# EAGLE schematic tinycopter v2 (EAGLE 6.3)
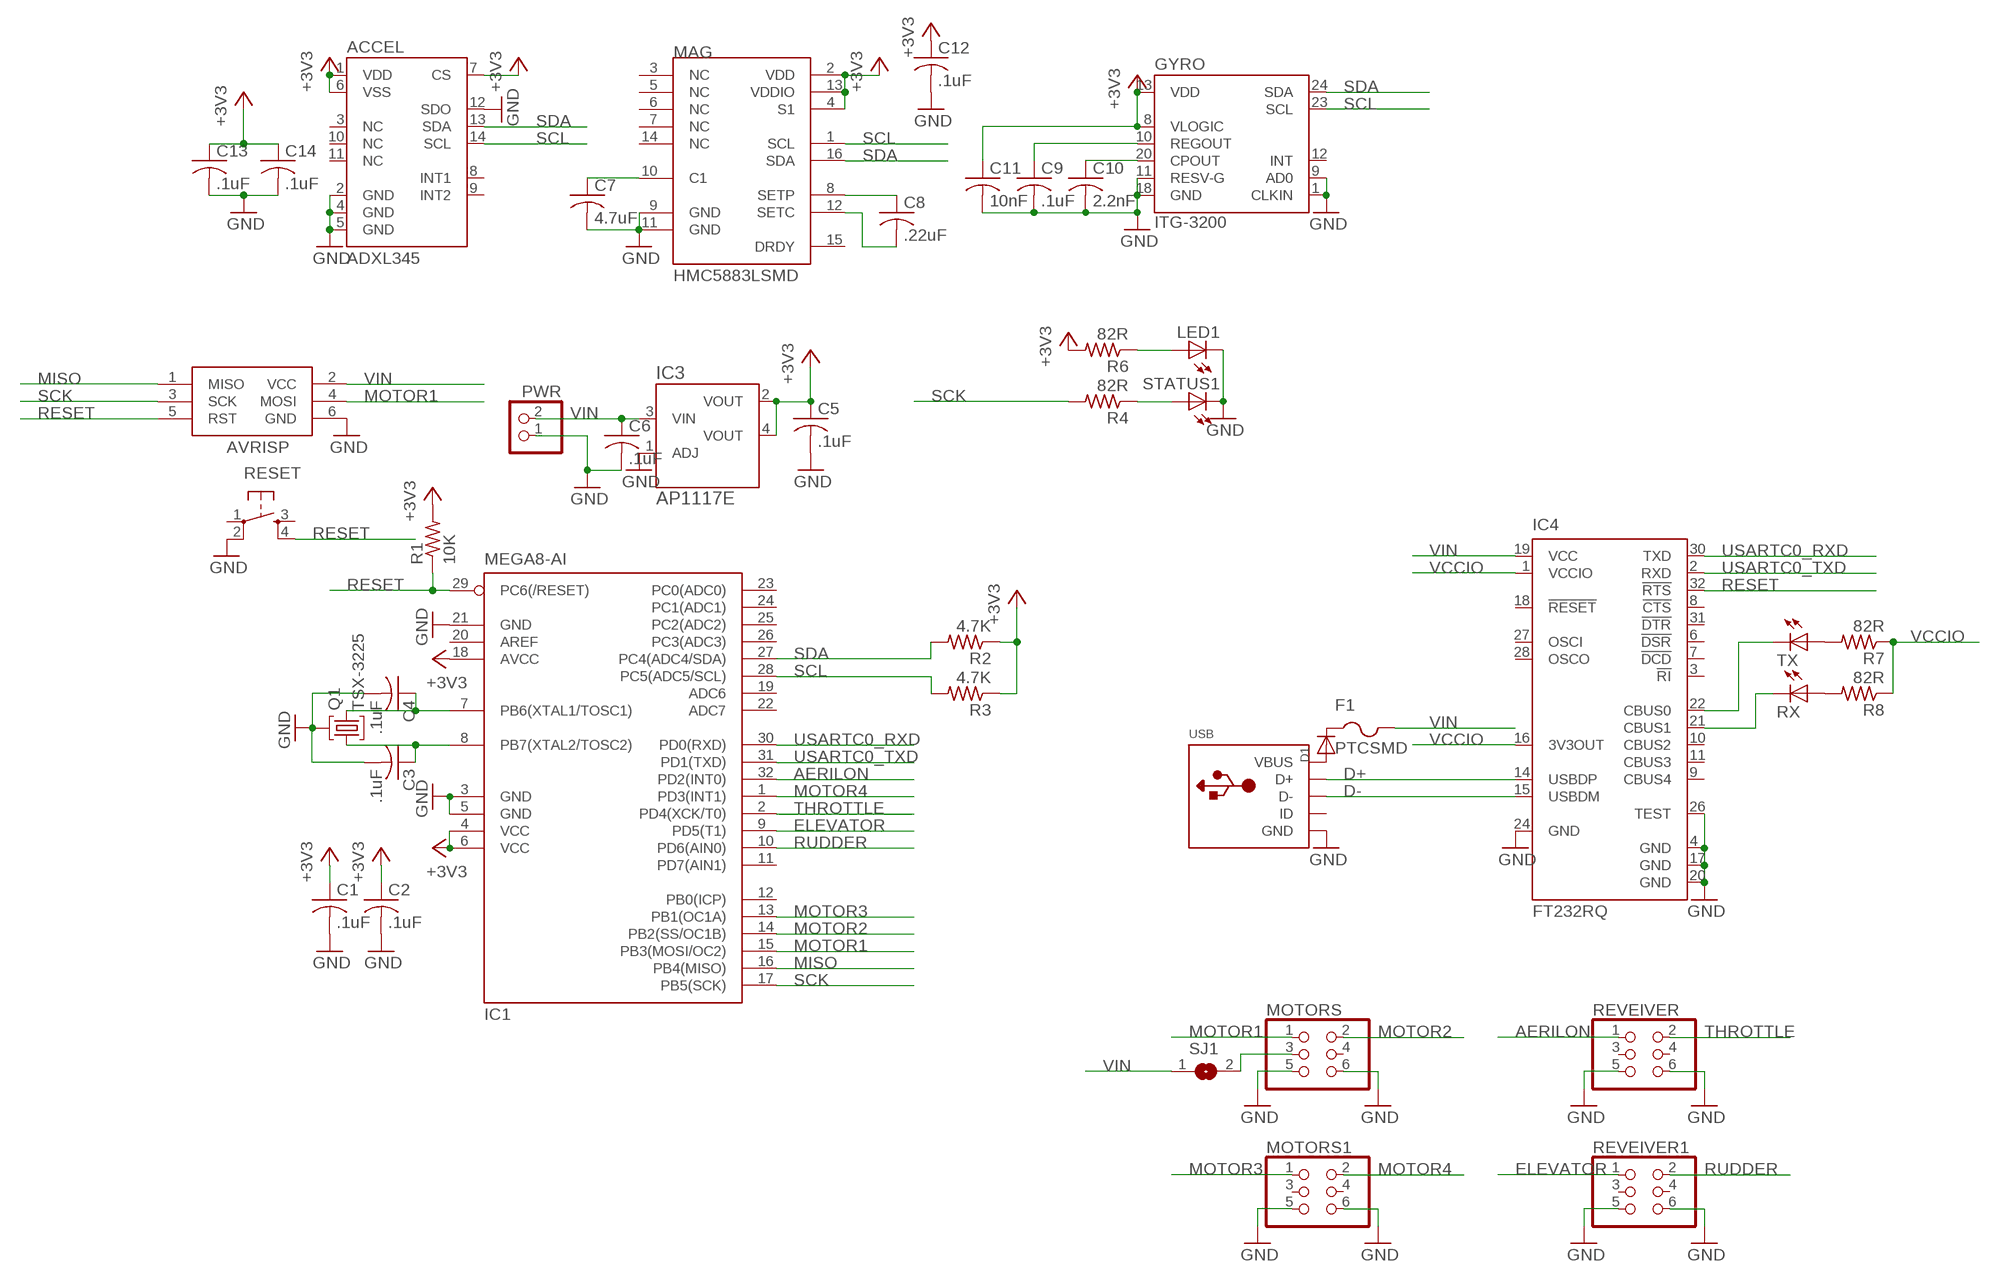
[diagram p0: schematic, sheet 1]

## Parts
ACCEL  ADXL345  [LGA14]
AVRISP  AVRISP-6  [AVRISP]
C1  .1uF  C-USC0603  [C0603]
C2  .1uF  C-USC0603  [C0603]
C3  .1uF  C-USC0603  [C0603]
C4  .1uF  C-USC0603  [C0603]
C5  .1uF  C-USC0603  [C0603]
C6  .1uF  C-USC0603  [C0603]
C7  4.7uF  C-USC0805K  [C0805K]
C8  .22uF  C-USC0603  [C0603]
C9  .1uF  C-USC0603  [C0603]
C10  2.2nF  C-USC0603  [C0603]
C11  10nF  C-USC0603  [C0603]
C12  .1uF  C-USC0603  [C0603]
C13  .1uF  C-USC0603  [C0603]
C14  .1uF  C-USC0603  [C0603]
D1  DIODESOD-123  [SOD-123]
F1  PTCSMD  PTCFUSE-1812  [1812]
GYRO  ITG-3200  [QFN-24]
IC1  MEGA8-AI  [TQFP32-08]
IC3  AP1117E  [SOT223-3]
IC4  FT232RQ  [QFN32]
LED1  LEDCHIP-LED0805  [CHIP-LED0805]
MAG  HMC5883LSMD  [16LPCC]
MOTORS  PINHD-2X3  [2X03]
MOTORS1  PINHD-2X3  [2X03]
PWR  JST_2PIN-THM  [JST-PH-2-THM]
Q1  TSX-3225  [TSX-3225]
R1  10K  R-US_R0603  [R0603]
R2  4.7K  R-US_R0603  [R0603]
R3  4.7K  R-US_R0603  [R0603]
R4  82R  R-US_R0603  [R0603]
R6  82R  R-US_R0603  [R0603]
R7  82R  R-US_R0603  [R0603]
R8  82R  R-US_R0603  [R0603]
RESET  TAC_SWITCHSMD  [TACTILE_SWITCH_SMD]
REVEIVER  PINHD-2X3  [2X03]
REVEIVER1  PINHD-2X3  [2X03]
RX  LEDCHIP-LED0805  [CHIP-LED0805]
SJ1  SJ  [SJ]
STATUS1  LEDCHIP-LED0805  [CHIP-LED0805]
TX  LEDCHIP-LED0805  [CHIP-LED0805]
USB  USBMINIB  [USB-MINIB]

## Nets
+3V3: ACCEL.1(VDD) ACCEL.6(VSS) ACCEL.7(CS) C1.1 C2.1 C5.1 C11.1 C12.1 C13.1 C14.1 GYRO.8(VLOGIC) GYRO.13(VDD) IC1.4(VCC) IC1.6(VCC) IC1.18(AVCC) IC3.2(VOUT) IC3.4(VOUT) MAG.2(VDD) MAG.4(S1) MAG.13(VDDIO) R1.2 R2.1 R3.1 R6.2
AERILON: IC1.32(PD2(INT0)) REVEIVER.1
D+: IC4.14(USBDP) USB.D+
D-: IC4.15(USBDM) USB.D-
ELEVATOR: IC1.9(PD5(T1)) REVEIVER1.1
GND: ACCEL.2(GND) ACCEL.4(GND) ACCEL.5(GND) ACCEL.12(SDO) AVRISP.6(GND) C1.2 C2.2 C3.2 C4.2 C5.2 C6.2 C7.2 C9.2 C10.2 C11.2 C12.2 C13.2 C14.2 GYRO.1(CLKIN) GYRO.9(AD0) GYRO.11(RESV-G) GYRO.18(GND) IC1.3(GND) IC1.5(GND) IC1.21(GND) IC3.1(ADJ) IC4.4(GND) IC4.17(GND) IC4.20(GND) IC4.24(GND) IC4.26(TEST) LED1.C MAG.9(GND) MAG.11(GND) MOTORS1.5 MOTORS1.6 MOTORS.5 MOTORS.6 PWR.1 Q1.2 Q1.4 RESET.2 REVEIVER1.5 REVEIVER1.6 REVEIVER.5 REVEIVER.6 STATUS1.C USB.GND
MISO: AVRISP.1(MISO) IC1.16(PB4(MISO))
MOTOR1: AVRISP.4(MOSI) IC1.15(PB3(MOSI/OC2)) MOTORS.1
MOTOR2: IC1.14(PB2(SS/OC1B)) MOTORS.2
MOTOR3: IC1.13(PB1(OC1A)) MOTORS1.1
MOTOR4: IC1.1(PD3(INT1)) MOTORS1.2
N$1: C4.1 IC1.7(PB6(XTAL1/TOSC1)) Q1.3
N$2: C3.1 IC1.8(PB7(XTAL2/TOSC2)) Q1.1
N$3: R4.1 STATUS1.A
N$5: C10.1 GYRO.20(CPOUT)
N$6: C7.1 MAG.10(C1)
N$7: C8.1 MAG.8(SETP)
N$8: LED1.A R6.1
N$9: C8.2 MAG.12(SETC)
N$10: C9.1 GYRO.10(REGOUT)
N$11: IC4.22(CBUS0) TX.C
N$12: IC4.21(CBUS1) RX.C
N$13: R7.2 TX.A
N$14: D1.A USB.VBUS
N$15: R8.2 RX.A
N$16: D1.C F1.1
N$17: MOTORS.3 SJ1.2
RESET: AVRISP.5(RST) IC1.29(PC6(/RESET)) IC4.32(!RTS) R1.1 RESET.4
RUDDER: IC1.10(PD6(AIN0)) REVEIVER1.2
SCK: AVRISP.3(SCK) IC1.17(PB5(SCK)) R4.2
SCL: ACCEL.14(SCL) GYRO.23(SCL) IC1.28(PC5(ADC5/SCL)) MAG.1(SCL) R3.2
SDA: ACCEL.13(SDA) GYRO.24(SDA) IC1.27(PC4(ADC4/SDA)) MAG.16(SDA) R2.2
THROTTLE: IC1.2(PD4(XCK/T0)) REVEIVER.2
USARTC0_RXD: IC1.30(PD0(RXD)) IC4.30(TXD)
USARTC0_TXD: IC1.31(PD1(TXD)) IC4.2(RXD)
VCCIO: IC4.1(VCCIO) IC4.16(3V3OUT) R7.1 R8.1
VIN: AVRISP.2(VCC) C6.1 F1.2 IC3.3(VIN) IC4.19(VCC) PWR.2 SJ1.1
Unconnected: ACCEL.3(NC) ACCEL.8(INT1) ACCEL.9(INT2) ACCEL.10(NC) ACCEL.11(NC) GYRO.12(INT) IC1.11(PD7(AIN1)) IC1.12(PB0(ICP)) IC1.19(ADC6) IC1.20(AREF) IC1.22(ADC7) IC1.23(PC0(ADC0)) IC1.24(PC1(ADC1)) IC1.25(PC2(ADC2)) IC1.26(PC3(ADC3)) IC4.3(!RI) IC4.6(!DSR) IC4.7(!DCD) IC4.8(!CTS) IC4.9(CBUS4) IC4.10(CBUS2) IC4.11(CBUS3) IC4.18(!RESET) IC4.27(OSCI) IC4.28(OSCO) IC4.31(!DTR) MAG.3(NC) MAG.5(NC) MAG.6(NC) MAG.7(NC) MAG.14(NC) MAG.15(DRDY) MOTORS1.3 MOTORS1.4 MOTORS.4 RESET.1 RESET.3 REVEIVER1.3 REVEIVER1.4 REVEIVER.3 REVEIVER.4 USB.ID

## Library data of the parts
ACCEL = SparkFun:ADXL345
AVRISP = icsp:AVRISP: AVR ISP HEADER Standard 6 pin header for AVR programming
C1-C14 = adafruit:C-US: CAPACITOR, American symbol
D1 = adafruit:DIODE: Diode SMADIODE - SMA Surface Mount Package 20V 1A Schottky Diode Digikey: 641-1014-6-ND DO-1N4148 - Through Hole Small Current Diode SOD-123 20V 1 A (.5mV Vf) Schottky Diode - Digikey: MBRX120TPMSCT-ND SOD-323 10V 570mA (.38mV Vf, 3ns) Schottky Diode - Digikey: ZLLS410CT-ND SOD-523 30V 30mA Schottky Diode (RB751S-40TE61) - Digikey: RB751S-40TE61CT-ND SOT23-R/W - SOT23 Package (R = Solder Paste/Reflow Ovens, W = Hand-Soldering) BAT54Film 40V 300mA - Digikey: 497-7162-1-ND
F1 = adafruit:PTCFUSE: PTC fuses, resettable thermistors
GYRO = SparkFun:ITG-3200: ITG-3200 3-axis gyro, digital output, qfn24 package
IC1 = atmel:MEGA8: MICROCONTROLLER 8 Kbytes FLASH, 1 kbytes SRAM, 512 bytes EEPROM, USART, 6-channel 10 bit ADC, 2-channel 8 bit ADC Pin compatible with Atmega48, ATMega88, ATMega168 Source: avr.lbr; MPN: ATMEGA8-16AU; OC_FARNELL: 9171371; OC_NEWARK: 73M8863
IC3 = Diodes Inc:AP1117: AP1117 1A Low Dropout Positive Adjustable or Fixed-Mode Regualtor Source: AP1117 Datasheet <http://www.diodes.com/datasheets/AP1117.pdf>
IC4 = ftdichip:FT232R: Source: http://www.ftdichip.com/Documents/DataSheets/DS_FT232R_v104.pdf; MPN: FT232RQ; OC_FARNELL: 1146033; OC_NEWARK: 91K9919
LED1 RX STATUS1 TX = adafruit:LED: LED OSRAM: - CHIPLED LG R971, LG N971, LY N971, LG Q971, LY Q971, LO R971, LY R971 LH N974, LH R974 LS Q976, LO Q976, LY Q976 LO Q996 - Hyper CHIPLED LW Q18S LB Q993, LB Q99A, LB R99A - SideLED LS A670, LO A670, LY A670, LG A670, LP A670 LB A673, LV A673, LT A673, LW A673 LH A674 LY A675 LS A676, LA A676, LO A676, LY A676, LW A676 LS A679, LY A679, LG A679 - Hyper Micro SIDELED® LS Y876, LA Y876, LO Y876, LY Y876 LT Y87S - SmartLED LW L88C, LW L88S LB L89C, LB L89S, LG L890 LS L89K, LO L89K, LY L89K LS L896, LA L896, LO L896, LY L896 - TOPLED LS T670, LO T670, LY T670, LG T670, LP T670 LSG T670, LSP T670, LSY T670, LOP T670, LYG T670 LG T671, LOG T671, LSG T671 LB T673, LV T673, LT T673, LW T673 LH T674 LS T676, LA T676, LO T676, LY T676, LB T676, LH T676, LSB T676, LW T676 LB T67C, LV T67C, LT T67C, LS T67K, LO T67K, LY T67K, LW E67C LS E67B, LA E67B, LO E67B, LY E67B, LB E67C, LV E67C, LT E67C LW T67C LS T679, LY T679, LG T679 LS T770, LO T770, LY T770, LG T770, LP T770 LB T773, LV T773, LT T773, LW T773 LH T774 LS E675, LA E675, LY E675, LS T675 LS T776, LA T776, LO T776, LY T776, LB T776 LHGB T686 LT T68C, LB T68C - Hyper Mini TOPLED® LB M676 - Mini TOPLED Santana® LG M470 LS M47K, LO M47K, LY M47K Source: http://www.osram.convergy.de/
MAG = SparkFun:HMC5883L: 3 Axis Digital Compass IC
MOTORS MOTORS1 REVEIVER REVEIVER1 = pinhead:PINHD-2X3: PIN HEADER
PWR = adafruit:JST_2PIN: JST 2-Pin Connectors of various flavors SMT-RA (S2B-PH-SM4) 4UConnector #17311 SMT (B2B-PH-SM4) THM-RA (S2B-PH) THM (B2B-PH)
Q1 = crystal:TSX-3225: TSX-3225 MHz Range Crystal Unit Miniature Size Low Profile SMD Frequency Range: 12MHz to 60MHz External Dimensions: 3.2 x 2.5 x 0.6 mm Overtone Order: Fundamental Applications: Mobile phone, Bluetooth, W-LAN ISM band radio, Clock for MPU Source: FA-238V / FA-238 / TSX-3225 Datasheet <http://www.eea.epson.com/portal/pls/portal/docs/1/1531444.PDF>
R1-R4 R6-R8 = adafruit:R-US_: RESISTOR, American symbol
RESET = SparkFun:TAC_SWITCH: Momentary Switch Button commonly used for reset or general input. Spark Fun Electronics SKU : COM-00097
SJ1 = jumper:SJ: SMD solder JUMPER
USB = icsp:USB: USB Connectors USBMINIB - Surface Mount Female Mini-B USB Connector 4UConnector: 06564 By microbuilder.eu Thru-hole RA Female Mini-B USB Connector 4UConnector: 18732 By ladyada.net